# Altium schematic sheet MAX9919.SchDoc
size A4; SheetNumber: 8; SheetTotal: 8
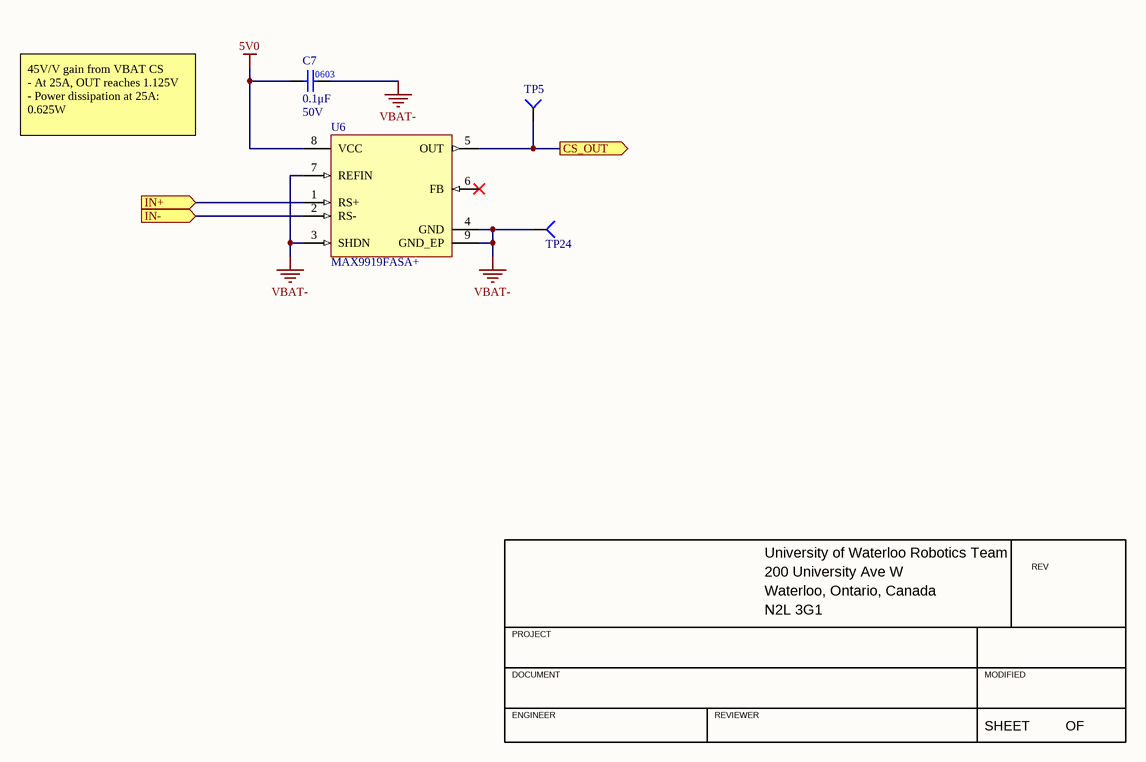
[diagram p0: MAX9919.SchDoc]

## Parts
C7  value 0.1μF  Voltage Rating: 50V  [CAP0603]  (hidden comment: CAP_0.1uF_50V_0603)
TP5  TESTPOINT_1MM_CIRCLE  [TESTPOINT_CIRCLE_1MM]  (value not drawn)  (no BOM)
TP24  TESTPOINT_SMD_LOOP  [S1751-46R]  (value not drawn)
U6  MAX9919FASA+  [8-SOIC_MAXIM_S8E+14]

## Ports
CS_OUT (out), IN+ (in), IN- (in)

## Nets
5V0: C7.1 U6.8(VCC)
VBAT-: C7.2 TP24.1(=value) U6.3(SHDN) U6.4(GND) U6.7(REFIN) U6.9(GND_EP)
CS_OUT: TP5.1(=value) U6.5(OUT) ; port CS_OUT
IN+: U6.1(RS+) ; port IN+
IN-: U6.2(RS-) ; port IN-

Not connected (* = marked no-connect by the designer): U6 6(FB)*

## Notes on the sheet
- 45V/V gain from VBAT CS
  - At 25A, OUT reaches 1.125V
  - Power dissipation at 25A: 0.625W
- University of Waterloo Robotics Team
- 200 University Ave W
- REV
- PROJECT
- Waterloo, Ontario, Canada
- N2L 3G1
- DOCUMENT
- ENGINEER
- REVIEWER
- MODIFIED
- SHEET
- OF

## Library data of the parts
C7 = CAP_0.1uF_50V_0603: CAP CER 0.1UF 50V X7R 0603; Manufacturer 1: Yageo; Manufacturer Part Number 1: CC0603KRX7R9BB104; Package/Footprint: 0603; Supplier 1: Digi-Key; Supplier Part Number 1: 311-1344-1-ND; Mounting Type: SMD; Dielectric: X7R
TP5 = TESTPOINT_1MM_CIRCLE: TESTPOINT 1MM CIRCLE
TP24 = TESTPOINT_SMD_LOOP: TESTPOINT SMD LOOP; Manufacturer 1: Harwin; Supplier 1: Digi-Key; Manufacturer Part Number 1: S1751-46R; Mounting Type: SMD; Package/Footprint: SMD; Supplier Part Number 1: 952-1478-1-ND
U6 = MAX9919FASA+: IC CURRENT SENSE 1 CIRCUIT 8SOIC; Manufacturer 1: Analog Devices Inc./Maxim Integrated; Package/Footprint: 8-SOIC; Supplier 1: Digi-Key; Supplier Part Number 1: MAX9919FASA+-ND; Manufacturer Part Number 1: MAX9919FASA+